# Altium schematic sheet sheet1.SchDoc
size A3; SheetNumber: 1; SheetTotal: 1
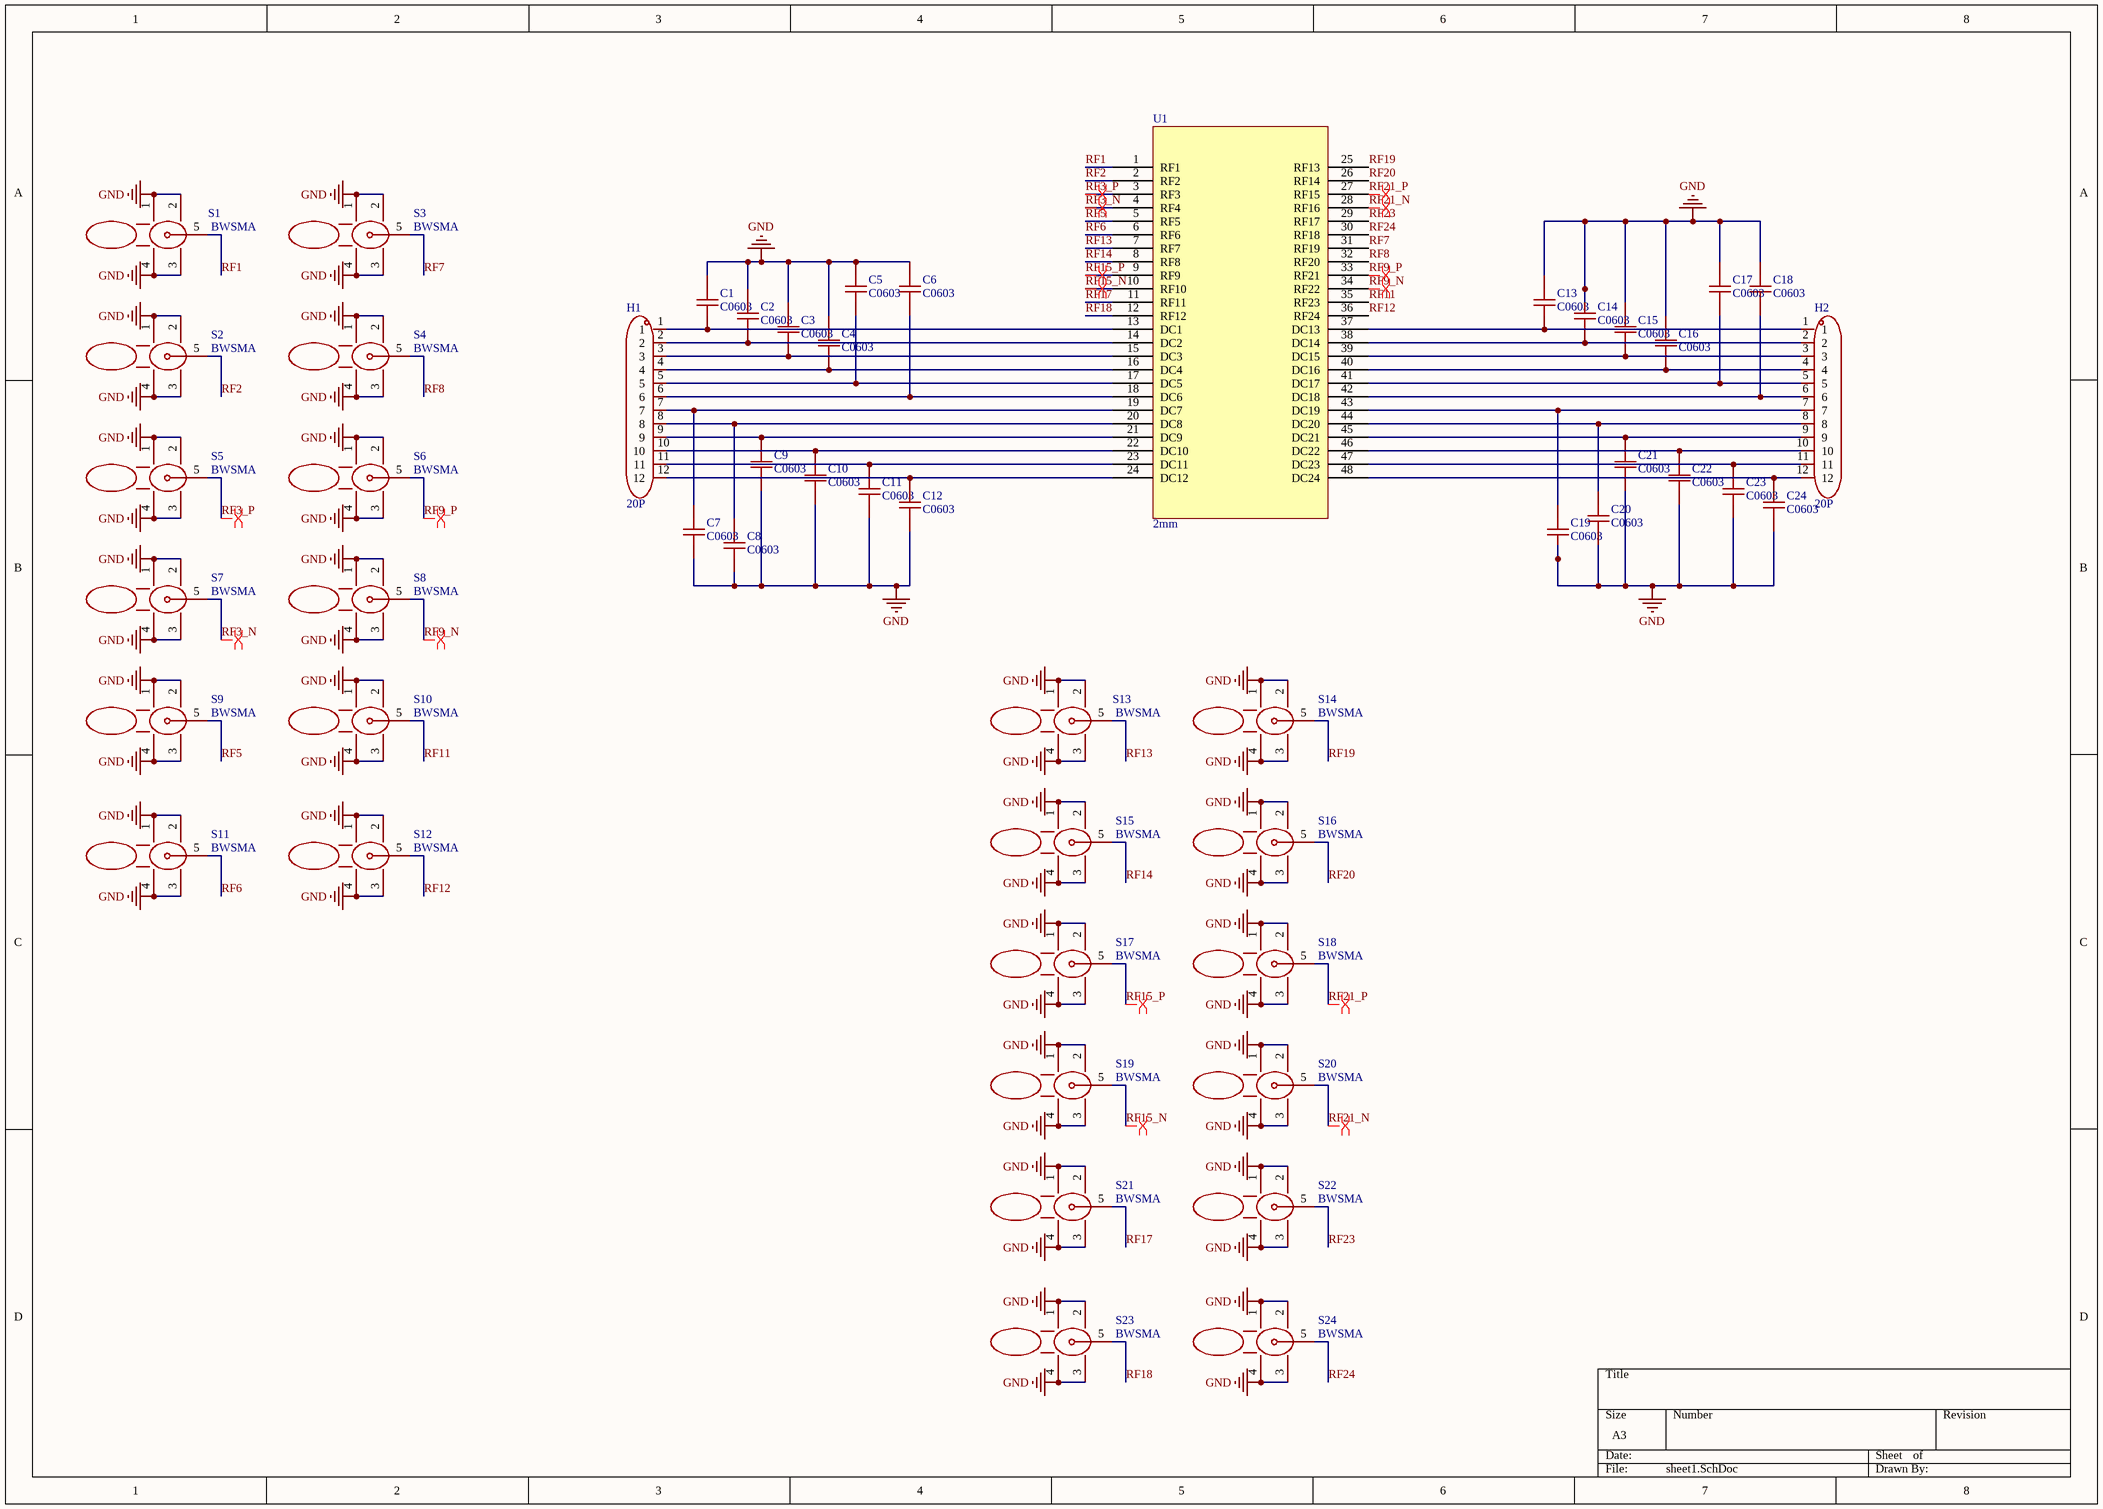
[diagram p0: sheet1.SchDoc]

## Parts
C1  C0603  [C0603]
C2  C0603  [C0603]
C3  C0603  [C0603]
C4  C0603  [C0603]
C5  C0603  [C0603]
C6  C0603  [C0603]
C7  C0603  [C0603]
C8  C0603  [C0603]
C9  C0603  [C0603]
C10  C0603  [C0603]
C11  C0603  [C0603]
C12  C0603  [C0603]
C13  C0603  [C0603]
C14  C0603  [C0603]
C15  C0603  [C0603]
C16  C0603  [C0603]
C17  C0603  [C0603]
C18  C0603  [C0603]
C19  C0603  [C0603]
C20  C0603  [C0603]
C21  C0603  [C0603]
C22  C0603  [C0603]
C23  C0603  [C0603]
C24  C0603  [C0603]
H1  20P  [20P]
H2  20P  [20P]
S1  BWSMA  [BWSMA]
S2  BWSMA  [BWSMA]
S3  BWSMA  [BWSMA]
S4  BWSMA  [BWSMA]
S5  BWSMA  [BWSMA]
S6  BWSMA  [BWSMA]
S7  BWSMA  [BWSMA]
S8  BWSMA  [BWSMA]
S9  BWSMA  [BWSMA]
S10  BWSMA  [BWSMA]
S11  BWSMA  [BWSMA]
S12  BWSMA  [BWSMA]
S13  BWSMA  [BWSMA]
S14  BWSMA  [BWSMA]
S15  BWSMA  [BWSMA]
S16  BWSMA  [BWSMA]
S17  BWSMA  [BWSMA]
S18  BWSMA  [BWSMA]
S19  BWSMA  [BWSMA]
S20  BWSMA  [BWSMA]
S21  BWSMA  [BWSMA]
S22  BWSMA  [BWSMA]
S23  BWSMA  [BWSMA]
S24  BWSMA  [BWSMA]
U1  2mm  [2mm]

## Nets
GND: C1.2 C2.2 C3.2 C4.2 C5.2 C6.2 C7.1 C8.1 C9.1 C10.1 C11.1 C12.1 C13.2 C14.2 C15.2 C16.2 C17.2 C18.2 C19.1 C20.1 C21.1 C22.1 C23.1 C24.1 S1.1 S1.2 S1.3 S1.4 S2.1 S2.2 S2.3 S2.4 S3.1 S3.2 S3.3 S3.4 S4.1 S4.2 S4.3 S4.4 S5.1 S5.2 S5.3 S5.4 S6.1 S6.2 S6.3 S6.4 S7.1 S7.2 S7.3 S7.4 S8.1 S8.2 S8.3 S8.4 S9.1 S9.2 S9.3 S9.4 S10.1 S10.2 S10.3 S10.4 S11.1 S11.2 S11.3 S11.4 S12.1 S12.2 S12.3 S12.4 S13.1 S13.2 S13.3 S13.4 S14.1 S14.2 S14.3 S14.4 S15.1 S15.2 S15.3 S15.4 S16.1 S16.2 S16.3 S16.4 S17.1 S17.2 S17.3 S17.4 S18.1 S18.2 S18.3 S18.4 S19.1 S19.2 S19.3 S19.4 S20.1 S20.2 S20.3 S20.4 S21.1 S21.2 S21.3 S21.4 S22.1 S22.2 S22.3 S22.4 S23.1 S23.2 S23.3 S23.4 S24.1 S24.2 S24.3 S24.4
RF1: S1.5 U1.1(RF1)
RF2: S2.5 U1.2(RF2)
RF3_N: S7.5 U1.4(RF4)
RF3_P: S5.5 U1.3(RF3)
RF5: S9.5 U1.5(RF5)
RF6: S11.5 U1.6(RF6)
RF7: S3.5 U1.31(RF19)
RF8: S4.5 U1.32(RF20)
RF9_N: S8.5 U1.34(RF22)
RF9_P: S6.5 U1.33(RF21)
RF11: S10.5 U1.35(RF23)
RF12: S12.5 U1.36(RF24)
RF13: S13.5 U1.7(RF7)
RF14: S15.5 U1.8(RF8)
RF15_N: S19.5 U1.10(RF10)
RF15_P: S17.5 U1.9(RF9)
RF17: S21.5 U1.11(RF11)
RF18: S23.5 U1.12(RF12)
RF19: S14.5 U1.25(RF13)
RF20: S16.5 U1.26(RF14)
RF21_N: S20.5 U1.28(RF16)
RF21_P: S18.5 U1.27(RF15)
RF23: S22.5 U1.29(RF17)
RF24: S24.5 U1.30(RF18)
NetC1_1: C1.1 H1.1 U1.13(DC1)
NetC2_1: C2.1 H1.2 U1.14(DC2)
NetC3_1: C3.1 H1.3 U1.15(DC3)
NetC4_1: C4.1 H1.4 U1.16(DC4)
NetC5_1: C5.1 H1.5 U1.17(DC5)
NetC6_1: C6.1 H1.6 U1.18(DC6)
NetC7_2: C7.2 H1.7 U1.19(DC7)
NetC8_2: C8.2 H1.8 U1.20(DC8)
NetC9_2: C9.2 H1.9 U1.21(DC9)
NetC10_2: C10.2 H1.10 U1.22(DC10)
NetC11_2: C11.2 H1.11 U1.23(DC11)
NetC12_2: C12.2 H1.12 U1.24(DC12)
NetC13_1: C13.1 H2.1 U1.37(DC13)
NetC14_1: C14.1 H2.2 U1.38(DC14)
NetC15_1: C15.1 H2.3 U1.39(DC15)
NetC16_1: C16.1 H2.4 U1.40(DC16)
NetC17_1: C17.1 H2.5 U1.41(DC17)
NetC18_1: C18.1 H2.6 U1.42(DC18)
NetC19_2: C19.2 H2.7 U1.43(DC19)
NetC20_2: C20.2 H2.8 U1.44(DC20)
NetC21_2: C21.2 H2.9 U1.45(DC21)
NetC22_2: C22.2 H2.10 U1.46(DC22)
NetC23_2: C23.2 H2.11 U1.47(DC23)
NetC24_2: C24.2 H2.12 U1.48(DC24)

## Layout directives
differential pair: RF3_N, RF3_P, RF9_N, RF9_P, RF15_N, RF15_P, RF21_N, RF21_P